# Altium schematic sheet SIGNAL_OUTPUT.SchDoc: Signal output
size A4; Author: eldar6776@hotmail.com; DrawnBy: Eldar Dedic; Organization: PROVEN d.o.o.; Address1: Adema Buće 102; Address2: 71000 Sarajevo; Address3: Federacija Bosne i Hercegovine; Address4: Bosna i Hercegovina; DocumentNumber: CD-26514; Revision: 001; SheetNumber: 7; SheetTotal: 8; ProjectName: KONTROLER TRANSPORTA MATERIJALA
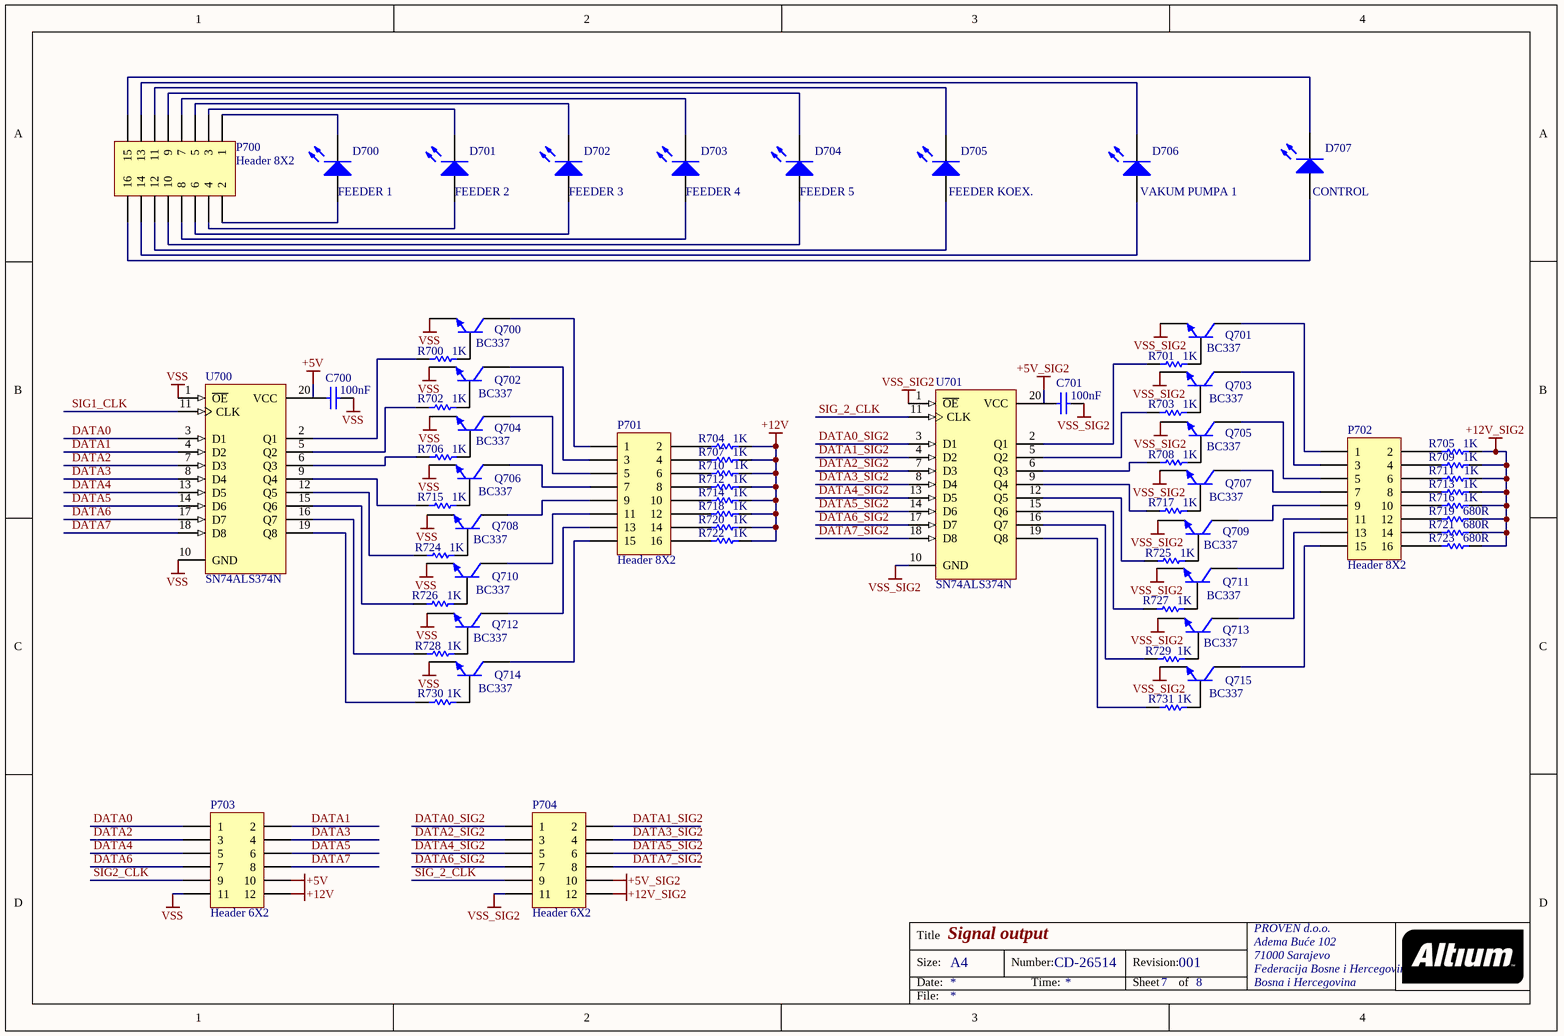
[diagram p0: SIGNAL_OUTPUT.SchDoc]

## Parts
C700  value 100nF  [1206]
C701  value 100nF  [1206]
D700  FEEDER 1  [LED-1]
D701  FEEDER 2  [LED-1]
D702  FEEDER 3  [LED-1]
D703  FEEDER 4  [LED-1]
D704  FEEDER 5  [LED-1]
D705  FEEDER KOEX.  [LED-1]
D706  VAKUM PUMPA 1  [LED-1]
D707  CONTROL  [LED-1]
P700  Header 8X2  [HDR2X8]
P701  Header 8X2  [HDR2X8]
P702  Header 8X2  [HDR2X8]
P703  Header 6X2  [HDR2X6]
P704  Header 6X2  [HDR2X6]
Q700  BC337  [29-04]
Q701  BC337  [29-04]
Q702  BC337  [29-04]
Q703  BC337  [29-04]
Q704  BC337  [29-04]
Q705  BC337  [29-04]
Q706  BC337  [29-04]
Q707  BC337  [29-04]
Q708  BC337  [29-04]
Q709  BC337  [29-04]
Q710  BC337  [29-04]
Q711  BC337  [29-04]
Q712  BC337  [29-04]
Q713  BC337  [29-04]
Q714  BC337  [29-04]
Q715  BC337  [29-04]
R700  1K  [ERA-0805]
R701  1K  [ERA-0805]
R702  1K  [ERA-0805]
R703  1K  [ERA-0805]
R704  1K  [ERA-0805]
R705  1K  [ERA-0805]
R706  1K  [ERA-0805]
R707  1K  [ERA-0805]
R708  1K  [ERA-0805]
R709  1K  [ERA-0805]
R710  1K  [ERA-0805]
R711  1K  [ERA-0805]
R712  1K  [ERA-0805]
R713  1K  [ERA-0805]
R714  1K  [ERA-0805]
R715  1K  [ERA-0805]
R716  1K  [ERA-0805]
R717  1K  [ERA-0805]
R718  1K  [ERA-0805]
R719  680R  [ERA-0805]
R720  1K  [ERA-0805]
R721  680R  [ERA-0805]
R722  1K  [ERA-0805]
R723  680R  [ERA-0805]
R724  1K  [ERA-0805]
R725  1K  [ERA-0805]
R726  1K  [ERA-0805]
R727  1K  [ERA-0805]
R728  1K  [ERA-0805]
R729  1K  [ERA-0805]
R730  1K  [ERA-0805]
R731  1K  [ERA-0805]
U700  SN74ALS374N  [N020D]
U701  SN74ALS374N  [N020D]

## Nets
+5V: C700.1 P703.10 U700.20(VCC)
+5V_SIG2: C701.1 P704.10 U701.20(VCC)
+12V: P703.12 R704.2 R707.2 R710.2 R712.2 R714.2 R718.2 R720.2 R722.2
+12V_SIG2: P704.12 R705.2 R709.2 R711.2 R713.2 R716.2 R719.2 R721.2 R723.2
VSS: C700.2 P703.11 Q700.3(E) Q702.3(E) Q704.3(E) Q706.3(E) Q708.3(E) Q710.3(E) Q712.3(E) Q714.3(E) U700.1(~{OE}) U700.10(GND)
VSS_SIG2: C701.2 P704.11 Q701.3(E) Q703.3(E) Q705.3(E) Q707.3(E) Q709.3(E) Q711.3(E) Q713.3(E) Q715.3(E) U701.1(~{OE}) U701.10(GND)
DATA0: P703.1 U700.3(D1)
DATA0_SIG2: P704.1 U701.3(D1)
DATA1: P703.2 U700.4(D2)
DATA1_SIG2: P704.2 U701.4(D2)
DATA2: P703.3 U700.7(D3)
DATA2_SIG2: P704.3 U701.7(D3)
DATA3: P703.4 U700.8(D4)
DATA3_SIG2: P704.4 U701.8(D4)
DATA4: P703.5 U700.13(D5)
DATA4_SIG2: P704.5 U701.13(D5)
DATA5: P703.6 U700.14(D6)
DATA5_SIG2: P704.6 U701.14(D6)
DATA6: P703.7 U700.17(D7)
DATA6_SIG2: P704.7 U701.17(D7)
DATA7: P703.8 U700.18(D8)
DATA7_SIG2: P704.8 U701.18(D8)
SIG1_CLK: U700.11(CLK)
SIG2_CLK: P703.9
SIG_2_CLK: P704.9 U701.11(CLK)
NetD700_1: D700.1(A) P700.2
NetD700_2: D700.2(K) P700.1
NetD701_1: D701.1(A) P700.4
NetD701_2: D701.2(K) P700.3
NetD702_1: D702.1(A) P700.6
NetD702_2: D702.2(K) P700.5
NetD703_1: D703.1(A) P700.8
NetD703_2: D703.2(K) P700.7
NetD704_1: D704.1(A) P700.10
NetD704_2: D704.2(K) P700.9
NetD705_1: D705.1(A) P700.12
NetD705_2: D705.2(K) P700.11
NetD706_1: D706.1(A) P700.14
NetD706_2: D706.2(K) P700.13
NetD707_1: D707.1(A) P700.16
NetD707_2: D707.2(K) P700.15
NetP701_1: P701.1 Q700.1(C)
NetP701_2: P701.2 R704.1
NetP701_3: P701.3 Q702.1(C)
NetP701_4: P701.4 R707.1
NetP701_5: P701.5 Q704.1(C)
NetP701_6: P701.6 R710.1
NetP701_7: P701.7 Q706.1(C)
NetP701_8: P701.8 R712.1
NetP701_9: P701.9 Q708.1(C)
NetP701_10: P701.10 R714.1
NetP701_11: P701.11 Q710.1(C)
NetP701_12: P701.12 R718.1
NetP701_13: P701.13 Q712.1(C)
NetP701_14: P701.14 R720.1
NetP701_15: P701.15 Q714.1(C)
NetP701_16: P701.16 R722.1
NetP702_1: P702.1 Q701.1(C)
NetP702_2: P702.2 R705.1
NetP702_3: P702.3 Q703.1(C)
NetP702_4: P702.4 R709.1
NetP702_5: P702.5 Q705.1(C)
NetP702_6: P702.6 R711.1
NetP702_7: P702.7 Q707.1(C)
NetP702_8: P702.8 R713.1
NetP702_9: P702.9 Q709.1(C)
NetP702_10: P702.10 R716.1
NetP702_11: P702.11 Q711.1(C)
NetP702_12: P702.12 R719.1
NetP702_13: P702.13 Q713.1(C)
NetP702_14: P702.14 R721.1
NetP702_15: P702.15 Q715.1(C)
NetP702_16: P702.16 R723.1
NetQ700_2: Q700.2(B) R700.1
NetQ701_2: Q701.2(B) R701.1
NetQ702_2: Q702.2(B) R702.1
NetQ703_2: Q703.2(B) R703.1
NetQ704_2: Q704.2(B) R706.1
NetQ705_2: Q705.2(B) R708.1
NetQ706_2: Q706.2(B) R715.1
NetQ707_2: Q707.2(B) R717.1
NetQ708_2: Q708.2(B) R724.1
NetQ709_2: Q709.2(B) R725.1
NetQ710_2: Q710.2(B) R726.1
NetQ711_2: Q711.2(B) R727.1
NetQ712_2: Q712.2(B) R728.1
NetQ713_2: Q713.2(B) R729.1
NetQ714_2: Q714.2(B) R730.1
NetQ715_2: Q715.2(B) R731.1
NetR700_2: R700.2 U700.2(Q1)
NetR701_2: R701.2 U701.2(Q1)
NetR702_2: R702.2 U700.5(Q2)
NetR703_2: R703.2 U701.5(Q2)
NetR706_2: R706.2 U700.6(Q3)
NetR708_2: R708.2 U701.6(Q3)
NetR715_2: R715.2 U700.9(Q4)
NetR717_2: R717.2 U701.9(Q4)
NetR724_2: R724.2 U700.12(Q5)
NetR725_2: R725.2 U701.12(Q5)
NetR726_2: R726.2 U700.15(Q6)
NetR727_2: R727.2 U701.15(Q6)
NetR728_2: R728.2 U700.16(Q7)
NetR729_2: R729.2 U701.16(Q7)
NetR730_2: R730.2 U700.19(Q8)
NetR731_2: R731.2 U701.19(Q8)

## Notes on the sheet
- Title
- Size:
- Date:
- A4
- Number:
- Time:
- Revision:
- Sheet
- of
- File:

## Library data of the parts
C700 C701 = C1206: Ceramic Chip Capacitor - Standard; Published: 17-Jul-2002; LatestRevisionDate: 19-Mar-2004; LatestRevisionNote: Silkscreen size reduced.; DatasheetDocument: Mar-2001; PackageDocument: Mar-2001; PackageReference: 1206; Publisher: Altium Limited; Code_JEITA: 1206; Code_IPC: 3216 [1206]; ComponentLink1Description: Manufacturer Link; ComponentLink1URL: http://www.kemet.com/; ComponentLink2Description: Datasheet; ComponentLink2URL: http://www.kemet.com/kemet/web/homepage/kechome.nsf/vapubfilesname/F3102TA.pdf/$file/F3102TA.pdf
D700-D707 = LED1: Typical RED GaAs LED; Published: 8-Jun-2000; LatestRevisionDate: 08-Jul-2005; LatestRevisionNote: Mech Layer 1 removed.; PackageReference: LED-1; Publisher: Altium Limited; PackageDescription: LED; 2 Leads
P700-P702 = Header 8X2: Header, 8-Pin, Dual row; LatestRevisionDate: 17-Jul-2002; LatestRevisionNote: Re-released for DXP Platform.; Publisher: Altium Limited
P703 P704 = Header 6X2: Header, 6-Pin, Dual row; LatestRevisionDate: 17-Jul-2002; LatestRevisionNote: Re-released for DXP Platform.; Publisher: Altium Limited
Q700-Q715 = BC337-16: Amplifier Transistor NPN Silicon; Published: 29-Sep-2000; LatestRevisionDate: 17-Jul-2002; LatestRevisionNote: Re-released for DXP Platform.; DatasheetVersion: 1991; PackageVersion: 1996; PackageReference: 29-04; Publisher: Altium Limited; PackageDescription: TO, Flat Index; 3 In-Line, Axial Leads; Body Dia. 4.8mm; Leads 0.48 x 0.5 mm (max); ComponentLink1Description: Manufacturer Link; ComponentLink1URL: http://www.onsemi.com/site/products/landing?taxonomyID=194; ComponentLink2Description: Datasheet; ComponentLink2URL: http://www.onsemi.com/pub/Collateral/BC337-D.PDF
R700-R731 = ERA6Y: Rectangular Thick Film Chip Resistor, 10 Ohm to 1M Ohm Range, 0.1% and 0.5% Tolerance, 0805 Size, 0.1 W; Note: If flow soldering, adjust pad width of PCB Footprint to 0.7 - 0.8 times the width of the resistor.; Published: 17-Dec-2003; LatestRevisionDate: 19-Mar-2004; LatestRevisionNote: Silkscreen size reduced.; PackageDocument: Mar-2003; PackageReference: ERA-0805; Publisher: Altium Limited; Code_IPC: 2012 [0805]; ComponentLink1Description: Manufacturer Link; ComponentLink1URL: http://www.panasonic.com/industrial/components/resistive_products.htm; ComponentLink2Description: Datasheet; ComponentLink2URL: http://www.panasonic.com/industrial/components/pdf/AOA0000CE8.pdf
U700 U701 = SN74ALS374N: Octal D-Type Edge-Triggered Flip-Flop with 3-State Outputs; Published: 8-Jun-2000; LatestRevisionDate: 04-Mar-2005; LatestRevisionNote: Stylized 3D Model Added.; DatasheetVersion: May-1986; PackageVersion: Oct-1995; PackageReference: N020D; Publisher: Altium Limited; PackageDescription: DIP; 20 Leads; Row Spacing 7.62 mm; Pitch 2.54 mm; ComponentLink1Description: Manufacturer Link; ComponentLink1URL: http://www.ti.com/